# EAGLE design Fluke_PM9080_RS232 (EAGLE 8.0.1)
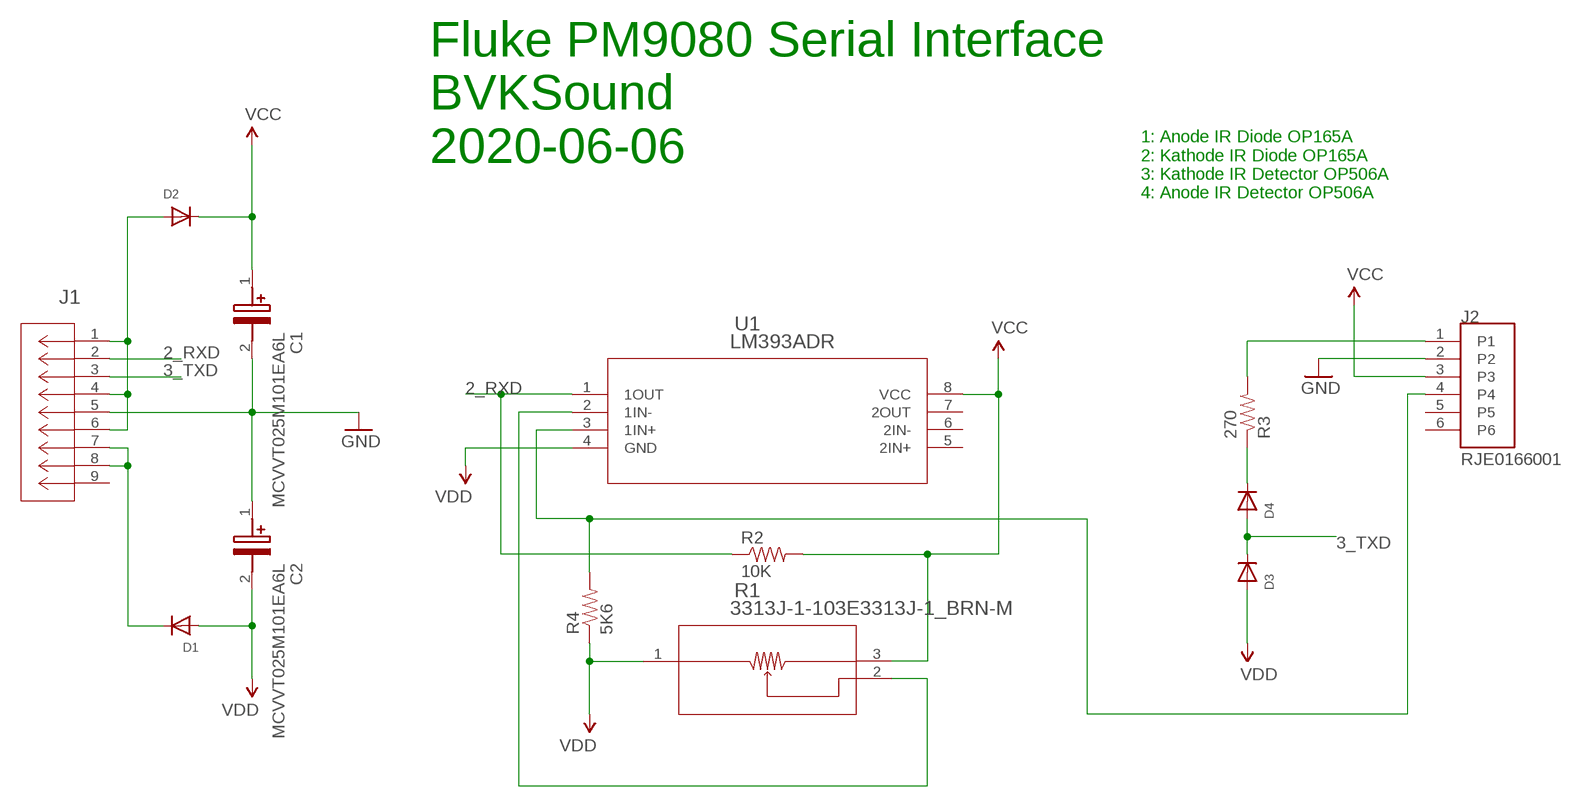
[diagram p0: schematic, sheet 1]

## Parts
C1  MCVVT025M101EA6L  [CAPAE830X1060N]
C2  MCVVT025M101EA6L  [CAPAE830X1060N]
D1  DIODESOD-123  [SOD-123]
D2  DIODESOD-123  [SOD-123]
D3  DIODESOD-123  [SOD-123]
D4  DIODESOD-123  [SOD-123]
J1  5747844-6  [CONN_5747844-6_TYC]
J2  RJE0166001  [AMPHENOL_RJE0166001]
R1  3313J-1-103E3313J-1_BRN-M  [3313J-1_BRN-M]
R2  10K  RESISTOR1206  [1206]
R3  270  RESISTOR1206  [1206]
R4  5K6  RESISTOR1206  [1206]
U1  LM393ADR  [D8]

## Nets
2_RXD: J1.2 R2.1 U1.1(1OUT)
3_TXD: D3.C D4.A J1.3
GND: C1.2(-) C2.1(+) J1.5 J2.2
N$1: D2.A J1.1 J1.4 J1.6
N$2: D1.C J1.7 J1.8
N$3: R1.2 U1.2(1IN-)
N$4: D4.C R3.1
N$5: J2.1 R3.2
N$6: J2.4 R4.2 U1.3(1IN+)
VCC: C1.1(+) D2.C J2.3 R1.3 R2.2 U1.8(VCC)
VDD: C2.2(-) D1.A D3.A R1.1 R4.1 U1.4(GND)
Unconnected: J1.9 J2.5 J2.6 U1.5(2IN+) U1.6(2IN-) U1.7(2OUT)

## Notes on the sheet
- Fluke PM9080 Serial Interface
  BVKSound
  2020-06-06
- 1: Anode IR Diode OP165A
  2: Kathode IR Diode OP165A
  3: Kathode IR Detector OP506A
  4: Anode IR Detector OP506A

## Library data of the parts
C1 C2 = bvk:MCVVT025M101EA6L: MULTICOMP - MCVVT025M101EA6L - CAP, ALU ELEC, 100UF, 25V, RAD CAN SMD Source: Datasheet <https://componentsearchengine.com/Datasheets/2/MCVVT025M101EA6L.pdf>; ARROW_PART_NUMBER: MCVVT025M101EA6L; DESCRIPTION: MULTICOMP - MCVVT025M101EA6L - CAP, ALU ELEC, 100UF, 25V, RAD CAN SMD; HEIGHT: 10.6mm; MANUFACTURER_NAME: MULTICOMP; MANUFACTURER_PART_NUMBER: MCVVT025M101EA6L
D1-D4 = adafruit:DIODE: Diode SMADIODE - SMA Surface Mount Package 20V 1A Schottky Diode Digikey: 641-1014-6-ND DO-1N4148 - Through Hole Small Current Diode SOD-123 20V 1 A (.5mV Vf) Schottky Diode - Digikey: MBRX120TPMSCT-ND SOD-323 10V 570mA (.38mV Vf, 3ns) Schottky Diode - Digikey: ZLLS410CT-ND SOD-523 30V 30mA Schottky Diode (RB751S-40TE61) - Digikey: RB751S-40TE61CT-ND SOT23-R/W - SOT23 Package (R = Solder Paste/Reflow Ovens, W = Hand-Soldering) BAT54Film 40V 300mA - Digikey: 497-7162-1-ND
J1 = bvk:5747844-6; BUILT_BY: EMA_UL_Team; MANUFACTURER_PART_NUMBER: 5747844-6; SOURCELIBRARY: Tyco_2012-04-26; VENDOR: TE Connectivity
J2 = bvk:RJE0166001: Conn RJ-11 SKT 6 POS 2.03mm Solder RA Thru-Hole 6 Terminal 1 Port Tray Cat 3; AVAILABILITY: Unavailable; DESCRIPTION: Jack Modular Connector 6p6c (RJ11, RJ12, RJ14, RJ25) 90° Angle (Right) Unshielded; DIGIKEY-PURCHASE-URL: https://snapeda.com/shop?store=DigiKey&id=458782; MF: Amphenol ICC; MP: RJE0166001; PACKAGE: None; PRICE: None
R1 = bvk:3313J-1-103E; BUILT_BY: EMA_Cory; COPYRIGHT: Copyright (C) 2018 Accelerated Designs. All rights reserved; DATASHEET: https://www.bourns.com/docs/Product-Datasheets/3313.pdf; MANUFACTURER_PART_NUMBER: 3313J-1-103E; SOURCELIBRARY: Bourns_Electronics_2020-06-04; VENDOR: Bourns Electronics
R2-R4 = SparkFun-Passives:RESISTOR: Resistor Basic schematic elements and footprints for 0603, 1206, and PTH resistors.
U1 = bvk:LM393ADR; BUILT_BY: EMA_UL_Team; MANUFACTURER: Texas Instruments; MANUFACTURER_PART_NUMBER: LM393ADR; VENDOR: Texas Instruments

## Board
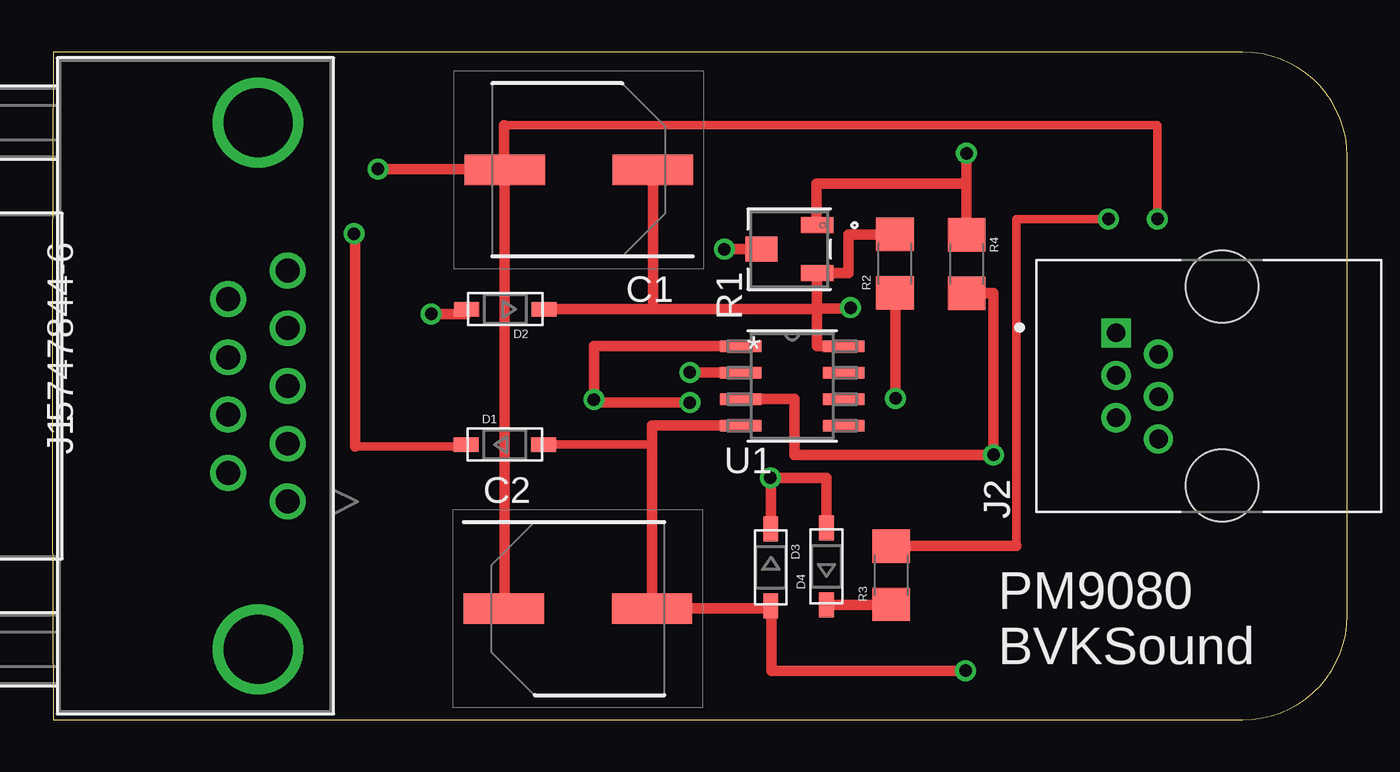
[diagram p1: board, top side]
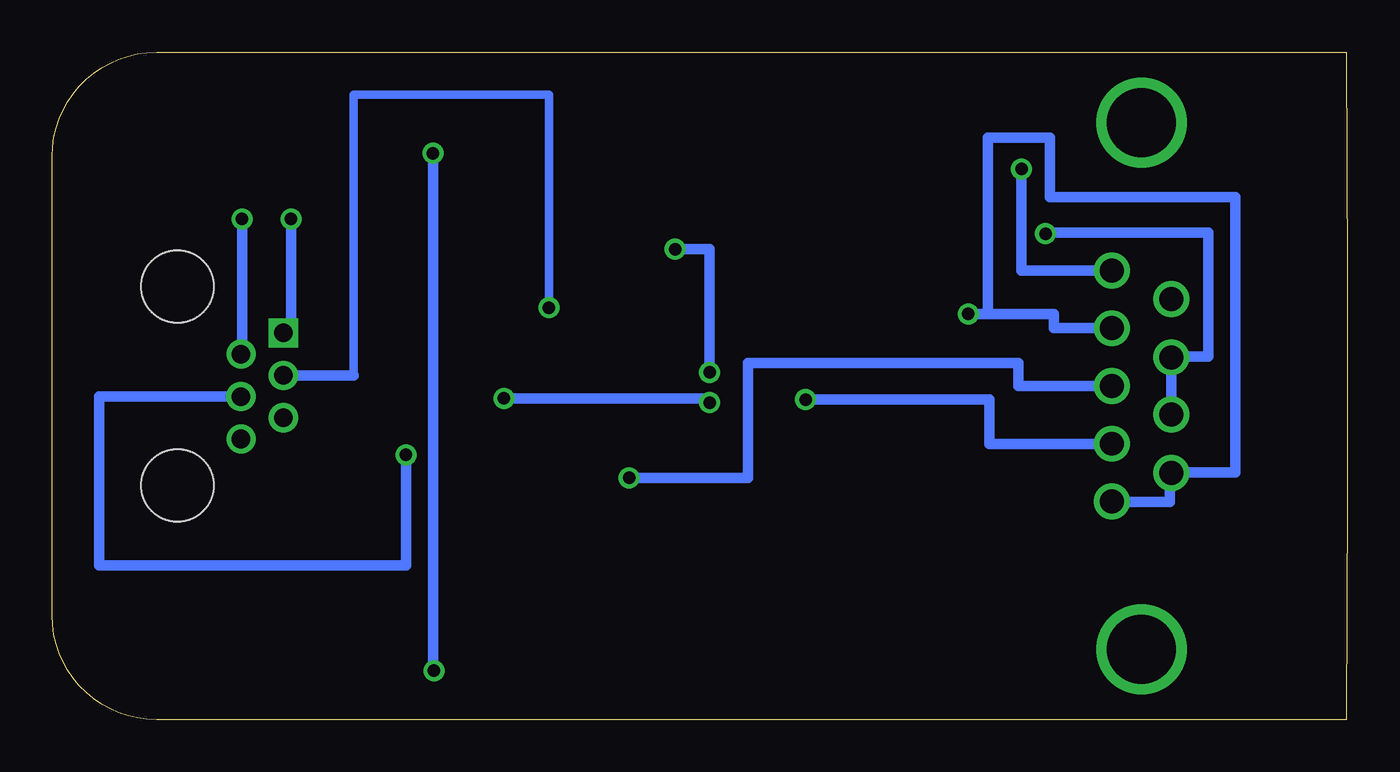
[diagram p2: board, bottom side, seen from below]

Size 62.06 x 32 mm. Coordinates in mm from the lower left corner, seen from the top.
Outline: 0.06,0 57.06,0 arc90 62.06,5 62.06,27 arc90 57.06,32 0.06,32 arc1 0.06,0
Copper layers (1*16): Top 0.035mm / dielectric 1.5mm / Bottom 0.035mm
Design rules "default": minimum track width 10mil, minimum drill 24mil, track to track 8mil, track to pad 8mil, pad to pad 8mil, via to via 8mil, smd to smd 8mil, copper to edge 40mil, drill to drill 8mil, minimum pad ring 10mil, minimum via ring 8mil, stop-mask expansion 4mil, vias tented up to drill 0mil, thermal gap 10mil

### Footprints (pad centres in the part's own frame; a part is rotated, then mirrored left to right if it is on the bottom)
CAPAE830X1060N = smd 3.85 x 1.45: 1 -3.55,0; 2 3.55,0
SOD-123 = smd 1.2 x 0.7: A 1.85,0; C -1.85,0
CONN_5747844-6_TYC = drill 1.143 pad 1.651: 1 -5.537,-10.922; 2 -2.769,-10.922; 3 0,-10.922; 4 2.769,-10.922; 5 5.537,-10.922; 6 -4.166,-8.077; 7 -1.372,-8.077; 8 1.372,-8.077; 9 4.166,-8.077 | drill 3.302 pad 3.302: 10 -12.624,-9.5; 11 12.624,-9.5
AMPHENOL_RJE0166001 = drill 0.89 square: 1 2.54,5.08 | drill 0.89: 2 1.524,3.05; 3 0.508,5.08; 4 -0.508,3.048; 5 -1.524,5.08; 6 -2.54,3.05 | hole 3.45: -4.763,0; 4.763,0; -4.763,0; 4.763,0
3313J-1_BRN-M = smd 0.762 x 1.549: 1 1.156,-1.333; 3 -1.156,-1.333 | smd 1.194 x 1.549: 2 0,1.333
1206 = smd 1.6 x 1.8: 1 -1.4,0; 2 1.4,0
D8 = smd 1.981 x 0.559: 1 -2.464,1.905; 2 -2.464,0.635; 3 -2.464,-0.635; 4 -2.464,-1.905; 5 2.464,-1.905; 6 2.464,-0.635; 7 2.464,0.635; 8 2.464,1.905

### Placement (x,y rotation side)
C1  25.23,26.36 180 top
C2  25.19,5.33 0 top
D1  21.69,13.19 0 top
D2  21.71,19.68 180 top
D3  34.43,7.3 270 top
D4  37.1,7.35 90 top
J1  0.36,16 90 top
J2  56.06,16 90 top
R1  35.32,22.56 90 top
R2  40.38,21.86 90 top
R3  40.21,6.93 90 top
R4  43.81,21.85 270 top
U1  35.46,16 0 top

### Tracks (layer width: path | path; a pad name or v marks a point on that pad's centre or on a via)
2_RXD  (via drill 0.6)
  Top 0.5: U1.1 25.96,17.91 v25.96,15.35 25.96,15.2 v30.56,15.2 | R2.1 40.41,20.46 v40.41,15.4
  Bottom 0.5: v25.96,15.35 17.16,15.35 17.16,13.23 J1.2 | v40.41,15.4 30.56,15.4 v30.56,15.2
3_TXD  (via drill 0.6)
  Top 0.5: D3.C 34.43,11.6 v34.41,11.6 37.11,11.6 D4.A
  Bottom 0.5: J1.3 15.76,16 15.76,17.1 28.71,17.1 28.71,11.6 v34.41,11.6
GND  (via drill 0.6)
  Top 0.406: 21.66,28.5 52.96,28.5 v52.96,24
  Top 0.5: v15.61,26.4 21.68,26.4 C1.2 | C2.1 21.68,5.33 C1.2 | C1.2 21.66,26.36 21.66,28.5 | 53.06,24 v52.96,24
  Bottom 0.5: J1.5 15.61,21.54 v15.61,26.4 | J2.2 52.96,17.52 v52.96,24
N$1  (via drill 0.6)
  Top 0.5: v18.16,19.45 19.86,19.45 D2.A
  Bottom 0.5: 17.21,19.45 17.21,27.9 14.26,27.9 14.26,25.05 5.36,25.05 5.36,11.85 8.44,11.85 J1.6 8.51,11.83 8.51,10.45 J1.1 | 17.21,19.45 14.06,19.45 14.06,18.77 J1.4 | 17.21,19.45 v18.16,19.45
N$2  (via drill 0.6)
  Top 0.406: 14.6,13.19 arc90 14.51,13.1 19.75,13.1 arc90 D1.C
  Top 0.5: v14.46,23.3 14.51,23.3 14.51,13.1
  Bottom 0.5: v14.46,23.3 14.46,23.35 6.66,23.35 6.66,17.4 8.44,17.4 J1.8 J1.7
N$3  (via drill 0.6)
  Top 0.5: R1.2 v32.21,22.56 v32.21,22.55 | v30.56,16.65 U1.2
  Bottom 0.5: v32.21,22.55 30.56,22.55 v30.56,16.65
N$4
  Top 0.5: D4.C 40.21,5.5 R3.1
N$5  (via drill 0.6)
  Top 0.406: v50.61,24 46.21,24 46.21,8.33
  Top 0.5: 46.21,8.33 R3.2
  Bottom 0.5: J2.1 50.61,18.54 v50.61,24
N$6  (via drill 0.6)
  Top 0.5: U1.3 35.56,15.37 35.56,12.7 v45.11,12.7 45.11,20.45 R4.2
  Bottom 0.5: v45.11,12.7 45.11,7.4 59.81,7.4 59.81,15.49 J2.4
VCC  (via drill 0.6)
  Top 0.5: D2.C 28.78,19.68 | 28.78,19.68 C1.1 | U1.8 36.66,17.91 36.66,19.68 | 36.66,19.7 R1.3 38.16,21.4 38.16,23.26 R2.2 | 28.78,19.68 36.66,19.68 | 36.66,19.68 36.66,19.7 | 36.66,19.7 38.26,19.7 v38.26,19.75
  Bottom 0.406: v38.26,19.75 38.26,29.95 47.61,29.95 47.61,16.51
  Bottom 0.5: 47.61,16.51 J2.3
VDD  (via drill 0.6)
  Top 0.406: D1.A 28.73,13.19 arc90 28.74,13.2
  Top 0.5: U1.4 28.74,14.1 28.74,13.2 C2.2 34.43,5.33 D3.A 34.46,5.45 34.46,2.35 v43.76,2.35 | R1.1 36.61,23.72 36.61,25.7 43.81,25.7 | 43.81,25.7 R4.1 | v43.81,27.15 43.81,25.7
  Bottom 0.5: v43.76,2.35 43.81,2.35 v43.81,27.15

### Text on the board
tPlace: PM9080 / BVKSound